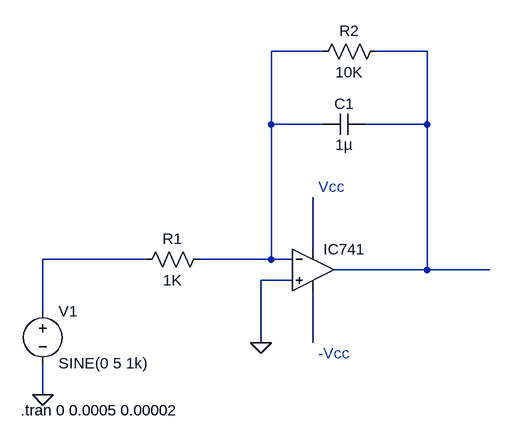
[diagram p0: schematic Integrator.asc]
Integrator.asc, the LTspice schematic file:
Version 4
SHEET 1 880 680
WIRE 208 -144 128 -144
WIRE 368 -144 288 -144
WIRE 128 -32 128 -144
WIRE 208 -32 128 -32
WIRE 368 -32 368 -144
WIRE 368 -32 272 -32
WIRE 192 160 192 80
WIRE -64 176 -224 176
WIRE 128 176 128 -32
WIRE 128 176 16 176
WIRE 160 176 128 176
WIRE 368 192 368 -32
WIRE 368 192 224 192
WIRE 464 192 368 192
WIRE 160 208 112 208
WIRE -224 256 -224 176
WIRE 112 304 112 208
WIRE 192 304 192 224
WIRE -224 384 -224 336
FLAG 112 304 0
FLAG -224 384 0
SYMBOL OpAmps\\UniversalOpamp2 192 192 R0
SYMATTR InstName IC741
SYMBOL res 32 160 R90
WINDOW 0 0 56 VBottom 2
WINDOW 3 32 56 VTop 2
SYMATTR InstName R1
SYMATTR Value 1K
SYMBOL voltage -224 240 R0
WINDOW 123 0 0 Left 0
WINDOW 39 0 0 Left 0
SYMATTR InstName V1
SYMATTR Value SINE(0 5 1k)
SYMBOL cap 272 -48 R90
WINDOW 0 0 32 VBottom 2
WINDOW 3 32 32 VTop 2
SYMATTR InstName C1
SYMATTR Value 1µ
SYMBOL res 304 -160 R90
WINDOW 0 0 56 VBottom 2
WINDOW 3 32 56 VTop 2
SYMATTR InstName R2
SYMATTR Value 10K
TEXT 200 64 Left 2 ;Vcc
TEXT 200 320 Left 2 ;-Vcc
TEXT -258 408 Left 2 !.tran 0 0.0005 0.00002

The netlist it stands for:
* Integrator.asc
XIC741 0 N001 N003 N005 N002 level.2 Avol=1Meg GBW=10Meg Slew=10Meg ilimit=25m rail=0 Vos=0 phimargin=45 en=0 enk=0 in=0 ink=0 Rin=500Meg  ; pins IN+ IN- V+ V- OUT
R1 N001 N004 1K
V1 N004 0 SINE(0 5 1k)
C1 N002 N001 1µ
R2 N002 N001 10K
* Vcc
* -Vcc
.tran 0 0.0005 0.00002
.lib UniversalOpamps2.sub
.backanno
.end